# Altium schematic sheet PoE Front End (FE).SchDoc
size A4; SheetNumber: 10; SheetTotal: 13
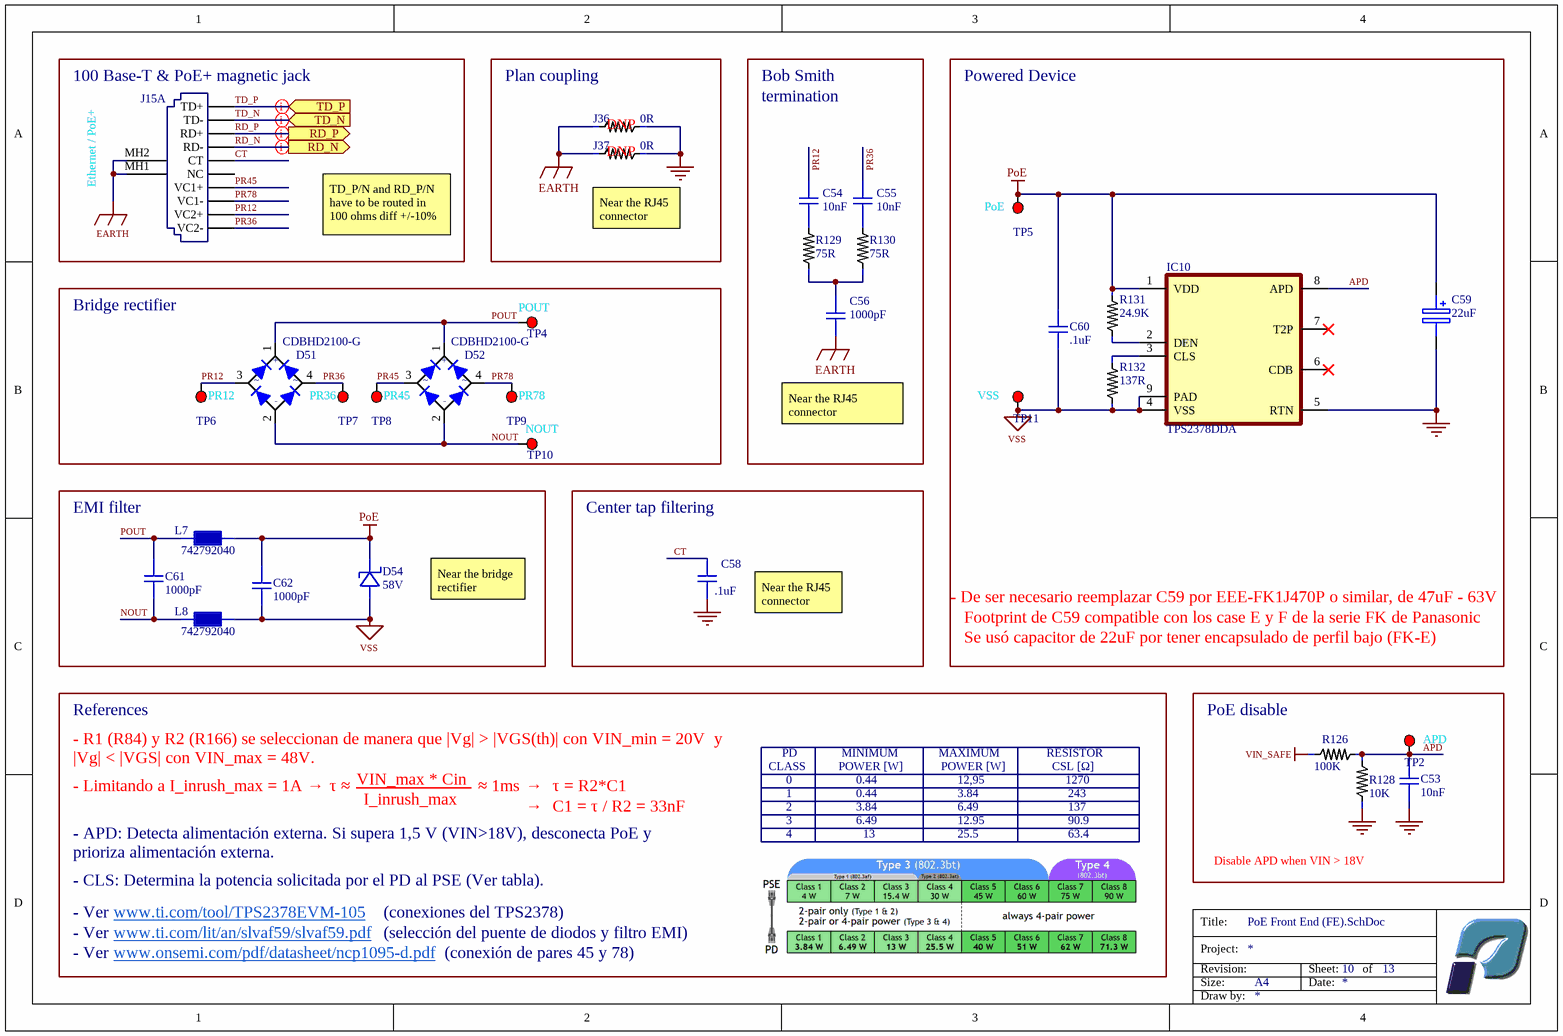
[diagram p0: PoE Front End (FE).SchDoc]

## Parts
C53  value 10nF  [C0805]  (hidden comment: Multilayer Ceramic Capacitors)
C54  value 10nF  [C0805]  (hidden comment: Multilayer Ceramic Capacitors)
C55  value 10nF  [C0805]  (hidden comment: Multilayer Ceramic Capacitors)
C56  value 1000pF  [C1206]  (hidden comment: High Voltage MLCC)
C58  value .1uF  [C0805]  (hidden comment: Multilayer Ceramic Capacitors)
C59  value 22uF  [C-FK-E]  (hidden comment: Aluminum Electrolytic Capacitors)
C60  value .1uF  [C0805]  (hidden comment: Multilayer Ceramic Capacitors)
C61  value 1000pF  [C0805]  (hidden comment: Multilayer Ceramic Capacitors)
C62  value 1000pF  [C0805]  (hidden comment: Multilayer Ceramic Capacitors)
D51  Part Number: CDBHD2100-G  [TO-269AA-4]  (hidden comment: Bridge Rectifier)
D52  Part Number: CDBHD2100-G  [TO-269AA-4]  (hidden comment: Bridge Rectifier)
D54  value 58V  [SOD-123]  (hidden comment: TVS Diodes 58V)
IC10  Part Number: TPS2378DDA  [HSOP-8]  (hidden comment: PD interface)
J15  Magnetic Jack  [J-ARJM11C7-104-AB-EW2]  (value not drawn)  (part A of 3)
J36  value 0R  [J0805]  (hidden comment: Thick Film Resistors)  (no BOM)
J37  value 0R  [J0805]  (hidden comment: Thick Film Resistors)  (no BOM)
L7  Part Number: 742792040  [L0805]  (hidden comment: Ferrite Beads)
L8  Part Number: 742792040  [L0805]  (hidden comment: Ferrite Beads)
R126  value 100K  [R0805]  (hidden comment: Thick Film Resistors)
R128  value 10K  [R0805]  (hidden comment: Thick Film Resistors)
R129  value 75R  [R0805]  (hidden comment: Thick Film Resistors)
R130  value 75R  [R0805]  (hidden comment: Thick Film Resistors)
R131  value 24.9K  [R0805]  (hidden comment: Thick Film Resistors)
R132  value 137R  [R0805]  (hidden comment: Thick Film Resistors)
TP2  Test point  [TP-1MM]  (value not drawn)  (no BOM)
TP4  Test point  [TP-1MM]  (value not drawn)  (no BOM)
TP5  Test point  [TP-1MM]  (value not drawn)  (no BOM)
TP6  Test point  [TP-1MM]  (value not drawn)  (no BOM)
TP7  Test point  [TP-1MM]  (value not drawn)  (no BOM)
TP8  Test point  [TP-1MM]  (value not drawn)  (no BOM)
TP9  Test point  [TP-1MM]  (value not drawn)  (no BOM)
TP10  Test point  [TP-1MM]  (value not drawn)  (no BOM)
TP11  Test point  [TP-1MM]  (value not drawn)  (no BOM)

## Blocks framed on the sheet
100 Base-T & PoE+ magnetic jack: J15
Plan coupling: J36 J37
Powered Device: C59 C60 IC10 R131 R132 TP5 TP11
Bridge rectifier: D51 D52 TP4 TP6-TP10
EMI filter: C61 C62 D54 L7 L8
Center tap filtering: C58
PoE disable: C53 R126 R128 TP2

## Ports
RD_N (out, see Main[1A], Ethernet Interface (EI)[1B]), RD_P (out, see Main[1A], Ethernet Interface (EI)[1B]), TD_N (in, see Main[1A], Ethernet Interface (EI)[1B]), TD_P (in, see Main[1A], Ethernet Interface (EI)[1A])

## Nets
EARTH: C56.2 J15.MH1 J15.MH2 J36.1 J37.1
GND: C53.2 C58.2 C59.2(-) IC10.5(RTN) J36.2 J37.2 R128.1
PoE: C59.1(+) C60.1 C62.1 D54.1 IC10.1(VDD) L7.2 R131.2 TP5.1
VIN_SAFE: R126.1
VSS: C60.2 C62.2 D54.2 IC10.4(VSS) IC10.9(PAD) L8.2 R132.1 TP11.1
APD: C53.1 IC10.8(APD) R126.2 R128.2 TP2.1
CT: C58.1 J15.5(CT)
NOUT: C61.2 D51.2(-) D52.2(-) L8.1 TP10.1
POUT: C61.1 D51.1(+) D52.1(+) L7.1 TP4.1
PR12: C54.1 D51.3 J15.9(VC2+) TP6.1
PR36: C55.1 D51.4 J15.10(VC2-) TP7.1
PR45: D52.3 J15.7(VC1+) TP8.1
PR78: D52.4 J15.8(VC1-) TP9.1
RD_N: J15.4(RD-) ; port RD_N
RD_P: J15.3(RD+) ; port RD_P
TD_N: J15.2(TD-) ; port TD_N
TD_P: J15.1(TD+) ; port TD_P
NetC54_2: C54.2 R129.2
NetC55_2: C55.2 R130.2
NetC56_1: C56.1 R129.1 R130.1
NetIC10_2: IC10.2(DEN) R131.1
NetIC10_3: IC10.3(CLS) R132.2

Not connected (* = marked no-connect by the designer): IC10 6(CDB)* 7(T2P)*; J15 6(NC)

## Layout directives
differential pair: RD_N, RD_P, TD_N, TD_P

## Notes on the sheet
- Bob Smith
- termination
- (near J36) DNP
- (near J37) DNP
- Ethernet / PoE+
- TD_P/N and RD_P/N have to be routed in 100 ohms diff +/-10%
- (near J37) Near the RJ45 connector
- (near TP5) PoE
- (near TP4) POUT
- (near TP6) PR12
- PR36
- PR45
- (near TP9) PR78
- (near TP10) NOUT
- Near the RJ45 connector
- (near TP11) VSS
- Near the bridge rectifier
- (near C58) Near the RJ45 connector
- - De ser necesario reemplazar C59 por EEE-FK1J470P o similar, de 47uF - 63V
- Se usó capacitor de 22uF por tener encapsulado de perfil bajo (FK-E)
- Footprint de C59 compatible con los case E y F de la serie FK de Panasonic
- References
- - Limitando a I_inrush_max = 1A →
- - R1 (R84) y R2 (R166) se seleccionan de manera que |Vg| > |VGS(th)| con VIN_min = 20V  y |Vg| < |VGS| con VIN_max = 48V.
- τ ≈
- VIN_max * Cin
- ≈
- 1ms
- →
- τ = R2*C1
- CLASS
- PD
- 0
- POWER [W]
- MINIMUM
- 0.44
- MAXIMUM
- 12,95
- RESISTOR
- CSL [Ω]
- 1270
- (near TP2) APD
- I_inrush_max
- C1 = τ / R2 = 33nF
- 1
- 2
- 3
- 4
- 3.84
- 6.49
- 13
- 12.95
- 25.5
- 243
- 137
- 90.9
- 63.4
- - APD: Detecta alimentación externa. Si supera 1,5 V (VIN>18V), desconecta PoE y
  prioriza alimentación externa.
- - CLS: Determina la potencia solicitada por el PD al PSE (Ver tabla).
- - Ver
- www.ti.com/tool/TPS2378EVM-105 <http://www.ti.com/tool/TPS2378EVM-105>
- (conexiones del TPS2378)
- Title:
- Disable APD when VIN > 18V
- www.ti.com/lit/an/slvaf59/slvaf59.pdf
- www.onsemi.com/pdf/datasheet/ncp1095-d.pdf
- (selección del puente de diodos y filtro EMI)
- (conexión de pares 45 y 78)
- Project:
- Revision:
- Size:
- A4
- Sheet:
- Date:
- of
- Draw by:

## Library data of the parts
C53-C55 = C-10nF-100V-0805: Multilayer Ceramic Capacitors MLCC - SMD/SMT 100V 0.01uF X7R 0805 10%; Part Number: C0805C103K1RACTU; Manufacturer: KEMET; Type: SMD; Case: 0805; Part Number 2: CC0805KRX7R0BB103; Manufacturer 2: YAGEO
C56 = C-1000pF-2kV-1206: Multilayer Ceramic Capacitors MLCC - SMD/SMT 2kV 1000pF X7R 1206 10%; Part Number: C1206C102KGRACTU; Manufacturer: KEMET; Type: SMD; Case: 1206; Part Number 2: CC1206KKX7RDBB102; Manufacturer 2: YAGEO
C58 = C-0.1uF-16V-0805: Multilayer Ceramic Capacitors MLCC - SMD/SMT 16V 0.1uF X7R 0805 10%; Part Number: C0805C104K4RACTU; Manufacturer: KEMET; Type: SMD; Case: 0805; Manufacturer 2: YAGEO; Part Number 2: CC0805KRX7R7BB104
C59 = C-22uF-63V: Aluminum Electrolytic Capacitors - SMD 22uF 63V; Manufacturer: Panasonic; Part Number: EEE-FK1J220P; Type: SMD; Case: *
C60 = C-0.1uF-100V-0805: Multilayer Ceramic Capacitors MLCC - SMD/SMT 100V 0.1uF X7R 0805 10%; Part Number: C0805C104K1RACTU; Manufacturer: KEMET; Type: SMD; Case: 0805; Manufacturer 2: YAGEO; Part Number 2: CC0805KKX7R0BB104
C61 C62 = C-1000pF-100V-0805: Multilayer Ceramic Capacitors MLCC - SMD/SMT 100V 1000pF X7R 0805 10%; Part Number: C0805C102K1RACTU; Manufacturer: KEMET; Type: SMD; Case: 0805; Part Number 2: CC0805KRX7R0BB102; Manufacturer 2: YAGEO
D51 D52 = D-CDBHD2100-G: Bridge Rectifiers 2A 100V Schottky Bridge; Manufacturer: Comchip Technology; Type: SMD; Case: TO-269AA-4
D54 = D-TVS-58V-SOD123: ESD Protection Diodes / TVS Diodes 200W 58V 5% Uni-directional; Part Number: SMF58A; Manufacturer: Littelfuse; Type: SMD; Case: SOD123; Part Number 2: PTVS58VS1UR,115; Manufacturer 2: Nexperia
IC10 = IC-TPS2378: IEEE 802.3at PoE High-Power PD Interface; Manufacturer: Texas Instruments; Type: SMD; Case: HSOP-8
J15 = J-ARJM11C7-104-AB-EW2: RJ45 Modular Connector, 8P8C, Shielded, THT, with Integrated Magnetics, Dual LEDs, EMI Fingers, PoE/PoE+ Compliant; Manufacturer: ABRACOM; Part Number: ARJM11C7-104-AB-EW2; Value: *; Type: TH; Case: *
J36 J37 = J-0805: Solder Bridge 0805 ON; Part Number: RC0805FR-070RL; Manufacturer: YAGEO; Type: SMD; Case: 0805
L7 L8 = L-600R-2A-0805: Ferrite Beads 600Ohm 2000mA Impedance@100MHz 0805; Manufacturer: Wurth Elektronik; Type: SMD; Case: 0805
R126 = R-100K-1%-0805: Thick Film Resistors - SMD 100 kOhms 125 mW 0805 1%; Part Number: RC0805FR-07100KL; Manufacturer: YAGEO; Type: SMD; Case: 0805
R128 = R-10K-1%-0805: Thick Film Resistors - SMD 10 kOhms 125 mW 0805 1%; Part Number: RC0805FR-0710KL; Manufacturer: YAGEO; Type: SMD; Case: 0805
R129 R130 = R-75R-1%-0805: Thick Film Resistors - SMD 75 Ohms 125 mW 0805 1%; Part Number: RC0805FR-0775RL; Manufacturer: YAGEO; Type: SMD; Case: 0805
R131 = R-24K9-1%-0805: Thick Film Resistors - SMD 24.9 kOhms 125 mW 0805 1%; Part Number: RC0805FR-0724K9L; Manufacturer: YAGEO; Type: SMD; Case: 0805
R132 = R-137R-1%-0805: Thick Film Resistors - SMD 137 Ohms 125 mW 0805 1%; Part Number: RC0805FR-07137RL; Manufacturer: YAGEO; Type: SMD; Case: 0805
TP2 TP4-TP11 = TP-1MM: Test Plugs & Test Jacks; Type: SMD; Part Number: *; Manufacturer: *; Case: *; Part Number 2: *; Manufacturer 2: *